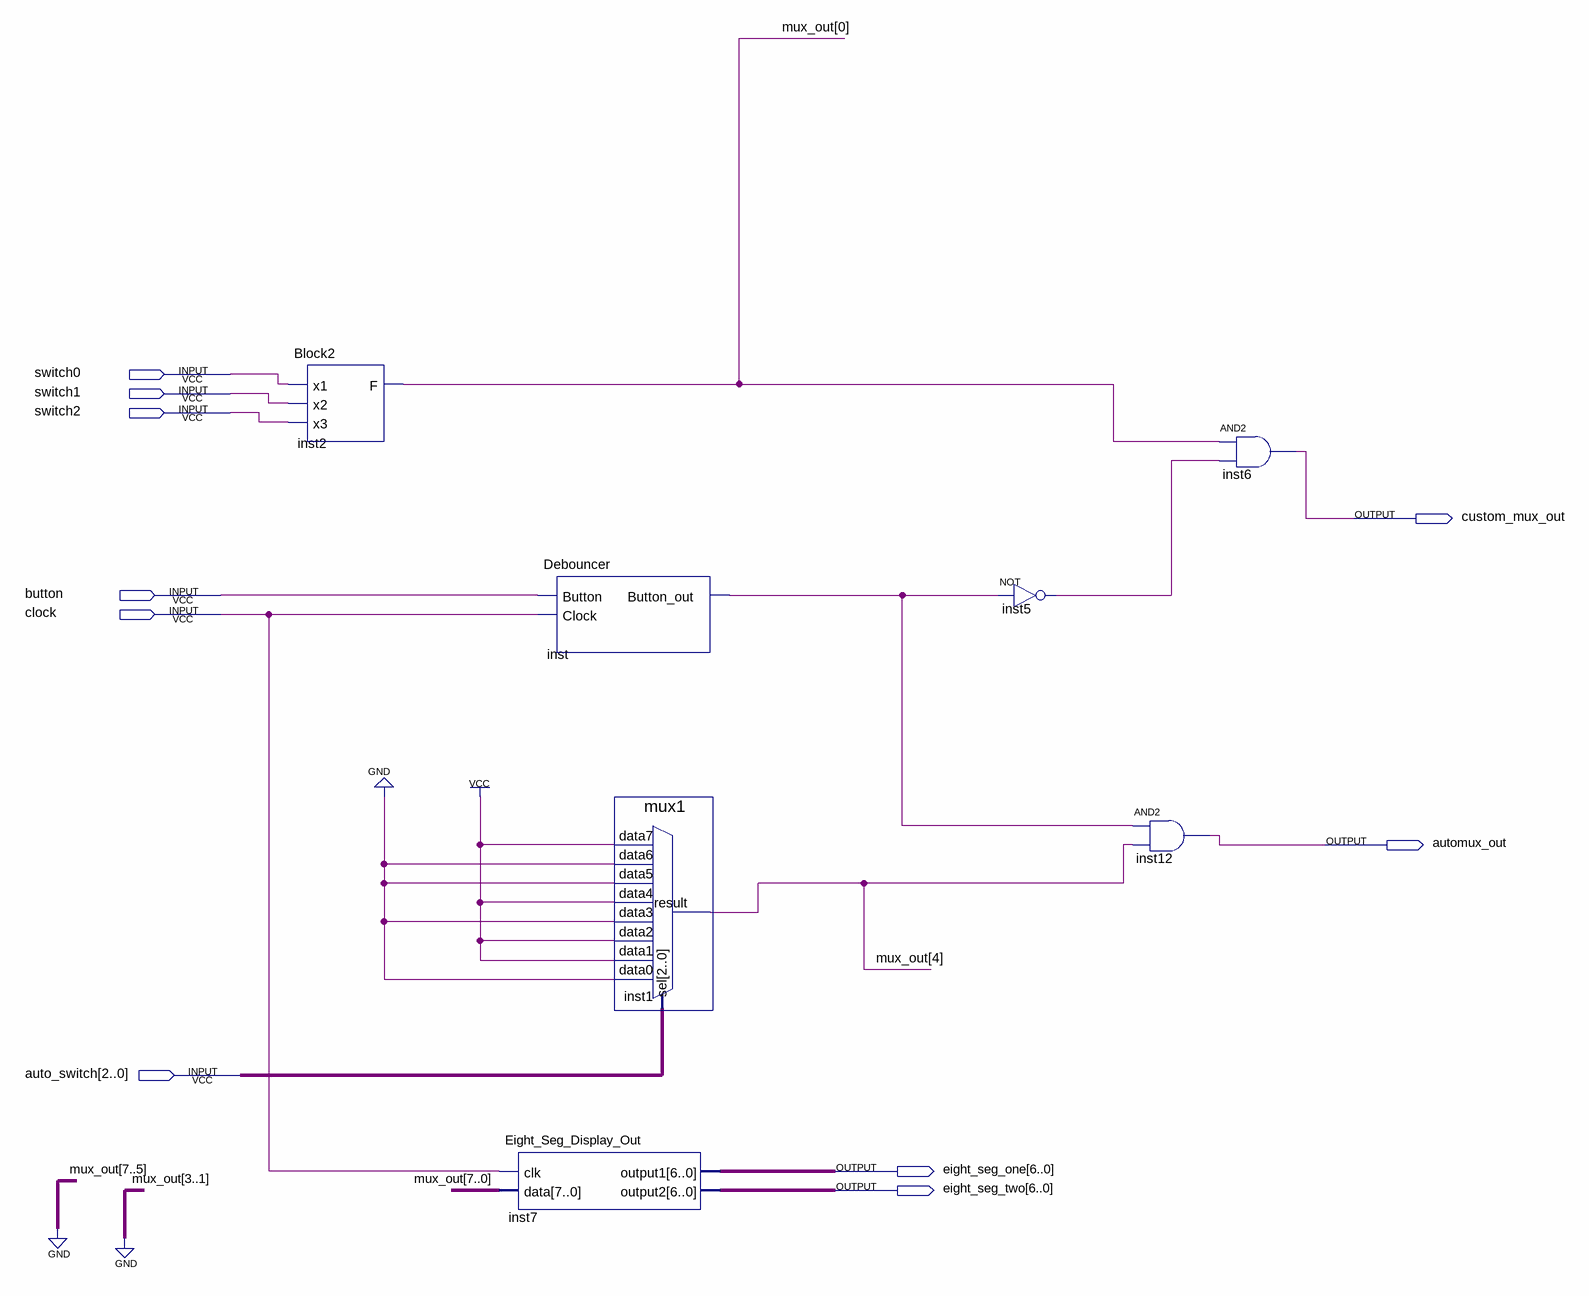
[diagram p0: schematic sheet]
// Quartus schematic seven_segment_display_top_level.bdf as structural Verilog: 7 symbols, 10 pins
module seven_segment_display_top_level (
  input  switch0,
  input  switch1,
  input  switch2,
  input  button,
  input  clock,
  input  [2:0] auto_switch,
  output custom_mux_out,
  output automux_out,
  output [6:0] eight_seg_one,
  output [6:0] eight_seg_two
);

  wire inst5_out, inst_button_out;
  wire [4:0] mux_out;

  Block2 inst2 (.x1(switch0), .x2(switch1), .x3(switch2), .F(mux_out[0]));
  Eight_Seg_Display_Out inst7 (
    .clk(clock), .data({3'b000, mux_out[4], 3'b000, mux_out[0]}), .output1(eight_seg_one),
    .output2(eight_seg_two));
  Debouncer inst (.Button(button), .Clock(clock), .Button_out(inst_button_out));
  mux1 inst1 (
    .data7(1'b1), .data6(1'b0), .data5(1'b0), .data4(1'b1), .data3(1'b0), .data2(1'b1), .data1(1'b1),
    .data0(1'b0), .sel(auto_switch), .result(mux_out[4]));
  not inst5 (inst5_out, inst_button_out);
  and inst12 (automux_out, inst_button_out, mux_out[4]);
  and inst6 (custom_mux_out, mux_out[0], inst5_out);
endmodule
